# EAGLE schematic astabil_multivibrator (EAGLE 6.3)
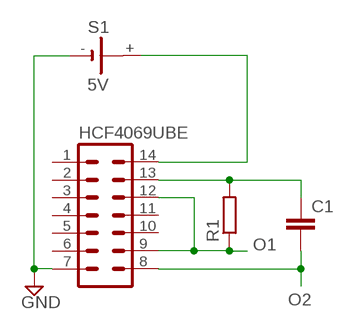
[diagram p0: schematic, sheet 1]

## Parts
C1  C-EU025-024X044  [C025-024X044]
HCF4069UBE  IC14P  [IC14P]
R1  R-EU_0204/2V  [0204V]
S1  5V  1V60R  [1V60R]

## Nets
GND: HCF4069UBE.7 S1.-
N$1: HCF4069UBE.14 S1.+
N$3: HCF4069UBE.9 HCF4069UBE.12 R1.1
N$4: C1.2 HCF4069UBE.8
N$5: C1.1 HCF4069UBE.13 R1.2
Unconnected: HCF4069UBE.1 HCF4069UBE.2 HCF4069UBE.3 HCF4069UBE.4 HCF4069UBE.5 HCF4069UBE.6 HCF4069UBE.10 HCF4069UBE.11 S1.+@1(+)

## Notes on the sheet
- O1
- O2

## Library data of the parts
C1 = resistor:C-EU: CAPACITOR, European symbol
HCF4069UBE = con-dil:IC14P: DIL CABLE CONNECTOR
R1 = resistor:R-EU_: RESISTOR, European symbol
S1 = battery:1V60R: NC ACCU Varta